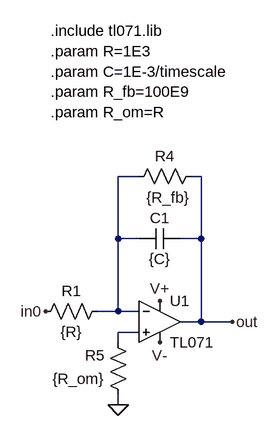
[diagram p0: schematic integrator.asc]
integrator.asc, the LTspice schematic file:
Version 4
SHEET 1 912 680
WIRE -784 -192 -816 -192
WIRE -688 -192 -704 -192
WIRE -816 -96 -816 -192
WIRE -784 -96 -816 -96
WIRE -688 -96 -688 -192
WIRE -688 -96 -720 -96
WIRE -816 16 -816 -96
WIRE -816 16 -848 16
WIRE -784 16 -816 16
WIRE -688 32 -688 -96
WIRE -688 32 -720 32
WIRE -640 32 -688 32
WIRE -784 48 -816 48
WIRE -816 64 -816 48
WIRE -816 160 -816 144
FLAG -928 16 in0
FLAG -640 32 out
FLAG -816 160 0
FLAG -752 0 V+
FLAG -752 64 V-
SYMBOL res -832 0 R90
WINDOW 0 0 56 VBottom 2
WINDOW 3 32 56 VTop 2
SYMATTR InstName R1
SYMATTR Value {R}
SYMBOL cap -720 -112 R90
WINDOW 0 0 32 VBottom 2
WINDOW 3 32 32 VTop 2
SYMATTR InstName C1
SYMATTR Value {C}
SYMATTR SpiceLine IC={ic}
SYMBOL res -688 -208 R90
WINDOW 0 0 56 VBottom 2
WINDOW 3 33 51 VTop 2
SYMATTR InstName R4
SYMATTR Value {R_fb}
SYMBOL res -800 160 R180
WINDOW 0 36 76 Left 2
WINDOW 3 36 40 Left 2
SYMATTR InstName R5
SYMATTR Value {R_om}
SYMBOL opamp2 -752 -32 R0
SYMATTR InstName U1
SYMATTR Value TL071
TEXT -920 -416 Left 2 !.include tl071.lib\n.param R=1E3\n.param C=1E-3/timescale\n.param R_fb=100E9\n.param R_om=R

The netlist it stands for:
* integrator.asc
R1 N001 in0 {R}
C1 out N001 {C} IC={ic}
R4 out N001 {R_fb}
R5 0 N002 {R_om}
XU1 N002 N001 V+ V- out TL071  ; pins In+ In- V+ V- OUT
.include tl071.lib
.param R=1E3
.param C=1E-3/timescale
.param R_fb=100E9
.param R_om=R
.backanno
.end